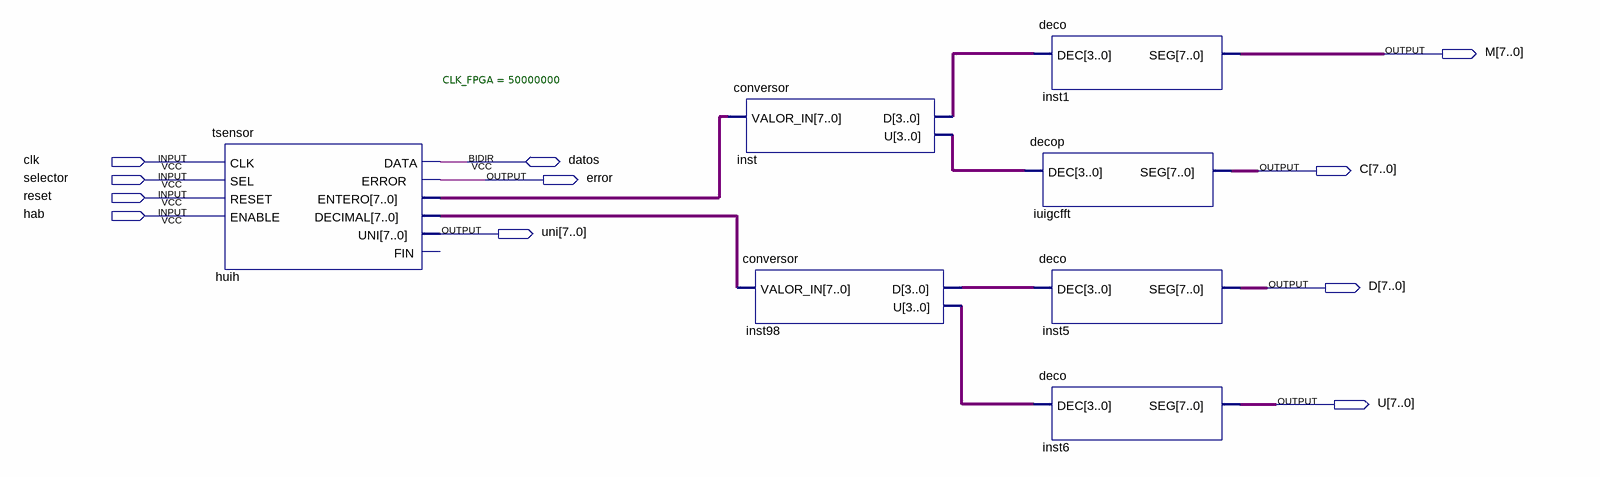
[diagram p0: schematic sheet]
// Quartus schematic SenT3.bdf as structural Verilog: 7 symbols, 11 pins
module SenT3 (
  input  clk,
  input  selector,
  input  reset,
  input  hab,
  inout  datos,
  output [7:0] M,
  output [7:0] C,
  output error,
  output [7:0] uni,
  output [7:0] D,
  output [7:0] U
);

  wire [3:0] inst98_d, inst98_u, inst_d, inst_u;
  wire [7:0] huih_decimal, huih_entero;

  tsensor #(.CLK_FPGA(50000000)) huih (
    .CLK(clk), .SEL(selector), .RESET(reset), .ENABLE(hab), .ERROR(error), .ENTERO(huih_entero),
    .DECIMAL(huih_decimal), .UNI(uni), .DATA(datos));  // open: FIN
  conversor inst (.VALOR_IN(huih_entero), .D(inst_d), .U(inst_u));
  conversor inst98 (.VALOR_IN(huih_decimal), .D(inst98_d), .U(inst98_u));
  deco inst1 (.DEC(inst_d), .SEG(M));
  decop iuigcfft (.DEC(inst_u), .SEG(C));
  deco inst5 (.DEC(inst98_d), .SEG(D));
  deco inst6 (.DEC(inst98_u), .SEG(U));
endmodule
